# EAGLE design power (EAGLE 6.4)
PyRadio
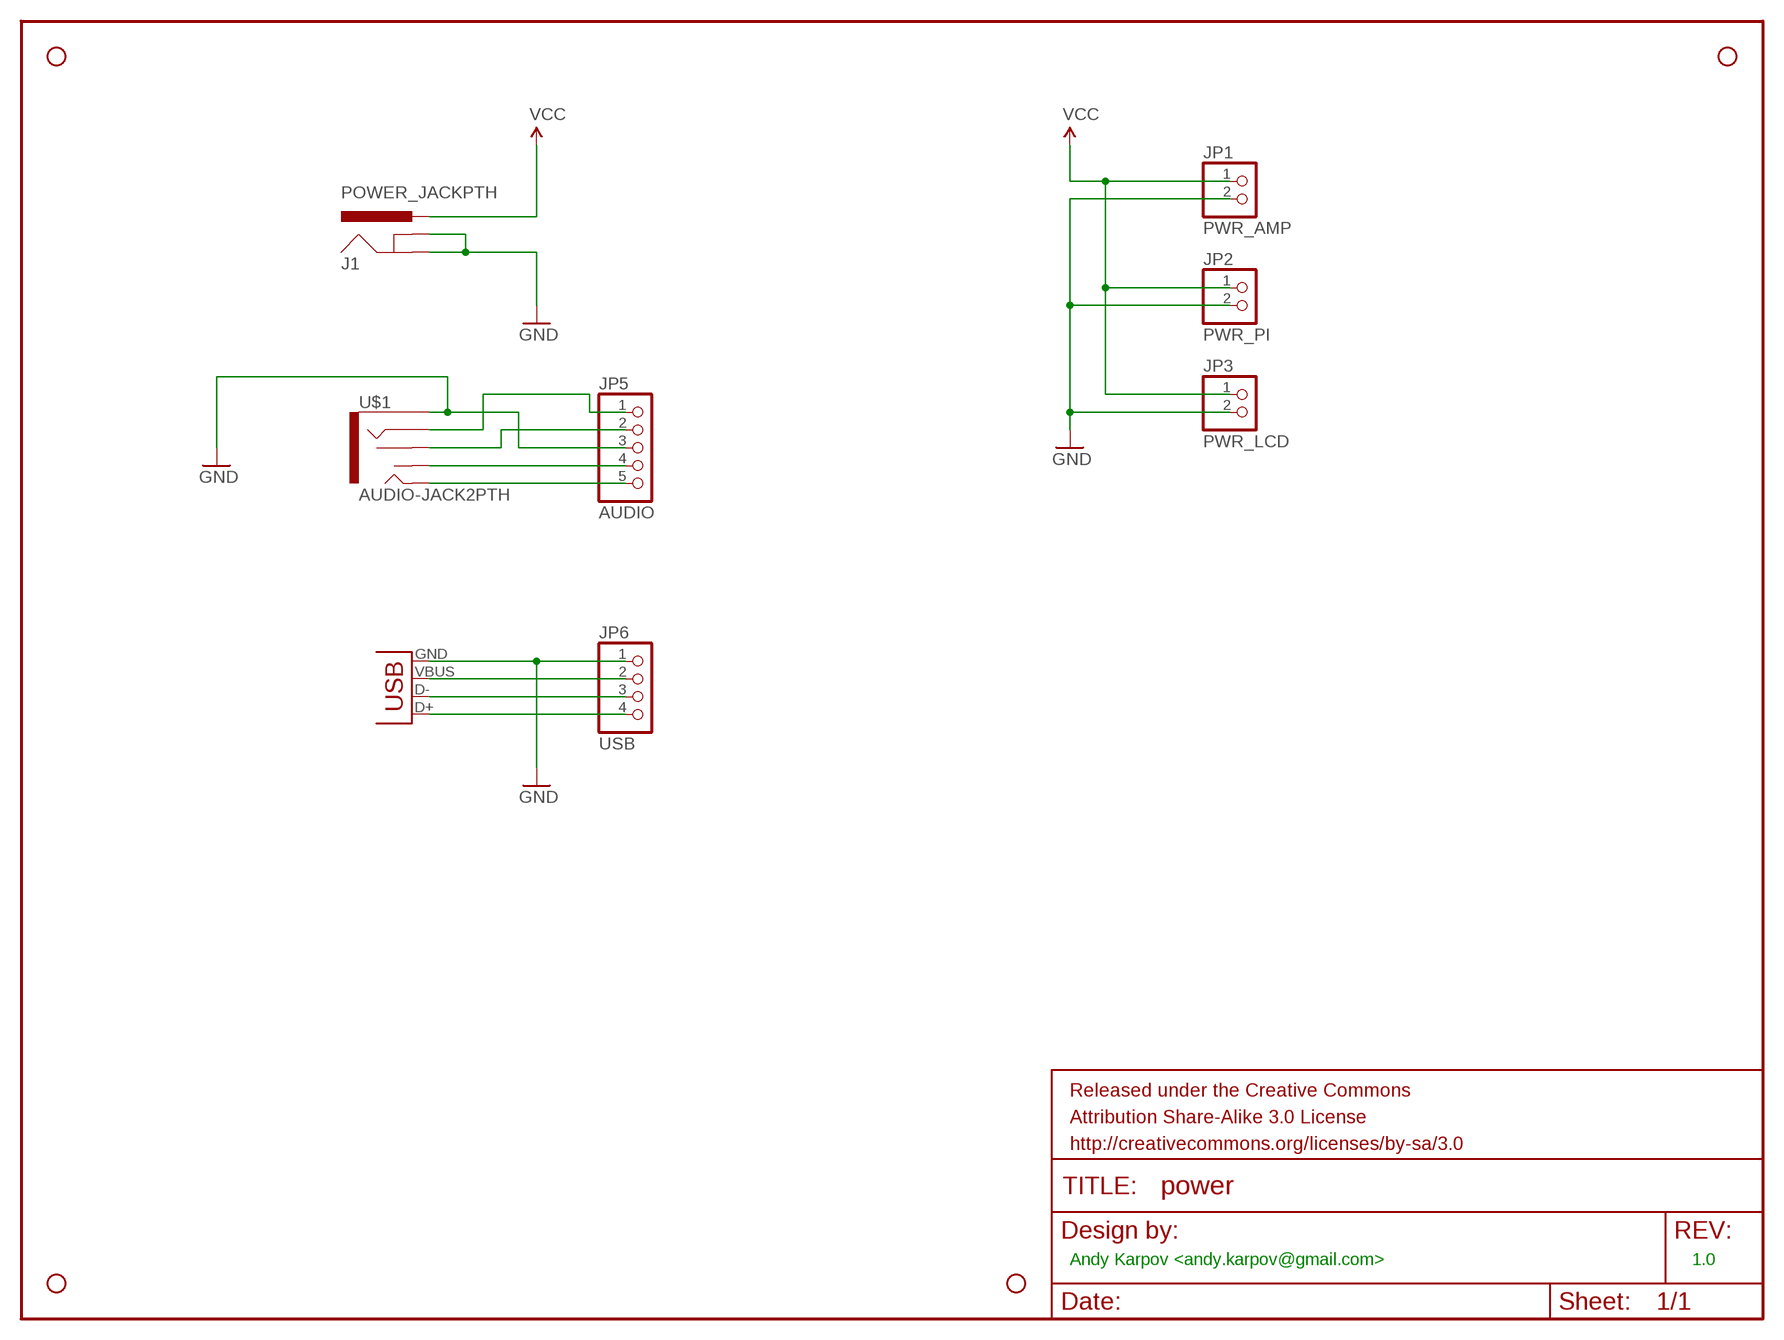
[diagram p0: schematic, sheet 1]

## Parts
FRAME1  FRAME-LETTER  [CREATIVE_COMMONS]
J1  POWER_JACKPTH  [POWER_JACK_PTH]
JP1  PWR_AMP  PINHD-1X2  [1X02]
JP2  PWR_PI  PINHD-1X2  [1X02]
JP3  PWR_LCD  PINHD-1X2  [1X02]
JP4  USB-B  USBPTH  [USB-B-PTH]
JP5  AUDIO  PINHD-1X5  [1X05]
JP6  USB  PINHD-1X4  [1X04]
STANDOFF1  STAND-OFF  [STAND-OFF]
STANDOFF2  STAND-OFF  [STAND-OFF]
STANDOFF3  STAND-OFF  [STAND-OFF]
STANDOFF4  STAND-OFF  [STAND-OFF]
U$1  AUDIO-JACK2PTH  [AUDIO-JACK]

## Nets
GND: J1.GND J1.GNDBREAK JP1.2 JP2.2 JP3.2 JP4.GND JP5.3 JP6.1 U$1.SLEEVE
N$2: JP4.D+ JP6.4
N$4: JP5.2 U$1.RSH
N$5: JP5.1 U$1.RING
N$10: JP4.VBUS JP6.2
N$11: JP4.D- JP6.3
N$26: JP5.5 U$1.TIP
N$27: JP5.4 U$1.TSH
VCC: J1.PWR JP1.1 JP2.1 JP3.1

## Notes on the sheet
- Andy Karpov <andy.karpov@gmail.com> | 1.0

## Library data of the parts
FRAME1 = SparkFun-Aesthetics:FRAME-LETTER: Schematic Frame Standard 8.5x11 US Letter frame
J1 = SparkFun-Connectors:POWER_JACK: Power Jack This is the standard 5.5mm barrel jack for power. The PTH is the most common, proven, reliable, footprint. The Slot footprint only works if the mill layer is transmitted to the PCB fab house so be warned. Spark Fun Electronics SKU : PRT-00119 SMT: CONN-08106 Mating wall wart : TOL-00298 (and others)
JP1-JP3 = pinhead:PINHD-1X2: PIN HEADER
JP4 = SparkFun-Connectors:USB: USB Connectors USB-B-PTH is fully proven SKU : PRT-00139/CONN-08278 USB-miniB is fully proven SKU : PRT-00587 USB-A-PCB is untested. USB-A-H is throughly reviewed, but untested. Spark Fun Electronics SKU : PRT-00437 USB-B-SMT is throughly reviewed, but untested. Needs silkscreen touching up. USB-A-S has not been used/tested USB-MB-H has not been used/tested USB-MICROB has been used. CONN-09505; PROD_ID: CONN-08278
JP5 = pinhead:PINHD-1X5: PIN HEADER
JP6 = pinhead:PINHD-1X4: PIN HEADER
STANDOFF1-STANDOFF4 = SparkFun-Electromechanical:STAND-OFF: #4 Stand Off This is the mechanical footprint for a #4 phillips button head screw. Use the keepout ring to avoid running the screw head into surrounding components. SKU : PRT-00447
U$1 = SparkFun-Connectors:AUDIO-JACK2: Stereo audio jack with bypass switches.

## Board
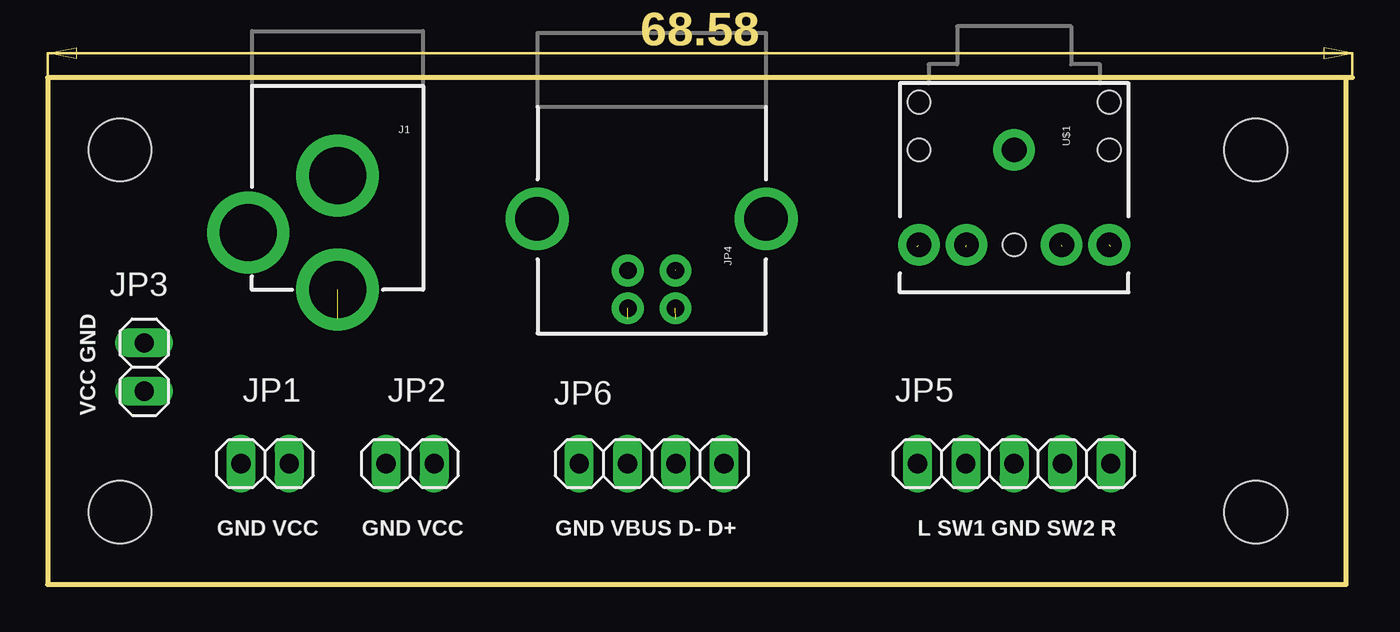
[diagram p1: board, top side]
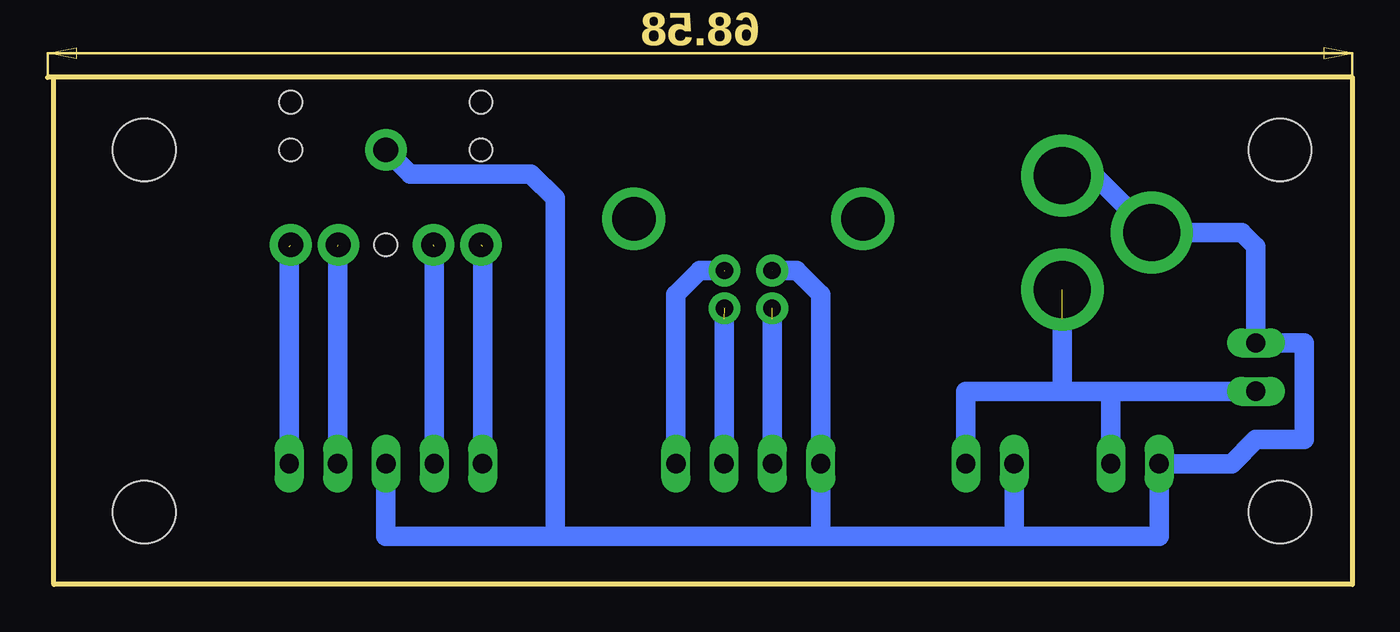
[diagram p2: board, bottom side, seen from below]

Size 68.58 x 26.67 mm. Coordinates in mm from the lower left corner, seen from the top.
Outline: 68.25,26.66 68.25,0 0,0 0,26.67 68.58,26.67
Copper layers (1*16): Top 0.035mm / dielectric 1.5mm / Bottom 0.035mm
Design rules "default": minimum track width 10mil, minimum drill 24mil, track to track 8mil, track to pad 8mil, pad to pad 8mil, via to via 8mil, smd to smd 8mil, copper to edge 40mil, drill to drill 8mil, minimum pad ring 10mil, minimum via ring 8mil, stop-mask expansion 4mil, vias tented up to drill 0mil, thermal gap 10mil

### Footprints (pad centres in the part's own frame; a part is rotated, then mirrored left to right if it is on the bottom)
POWER_JACK_PTH = drill 2.997 pad 4.318: GND 0,7.7; GNDBREAK 4.7,10.7; PWR 0,13.7
1X02 = drill 1.016 long: 1 -1.27,0; 2 1.27,0
USB-B-PTH = drill 0.914 pad 1.676: D+ 0,1.25; D- 1.981,1.25; GND 0,-1.25; VBUS 1.981,-1.25 | drill 2.286: S1 -2.718,-6.02; S2 -2.718,6.02
1X05 = drill 1.016 long: 1 -5.08,0; 2 -2.54,0; 3 0,0; 4 2.54,0; 5 5.08,0
1X04 = drill 1.016 long: 1 -3.81,0; 2 -1.27,0; 3 1.27,0; 4 3.81,0
STAND-OFF = hole 3.302: 0,0
AUDIO-JACK = drill 1.3 pad 2.184: RING 5,5; RSH 5,2.5; SLEEVE 0,0; TIP 5,-5; TSH 5,-2.5 | hole 1.2: 0,5; -2.5,5; -2.5,-5; 0,-5; 5,0

### Placement (x,y rotation side)
FRAME1  1.27,33.02 0 top  (outside the outline)
J1  15.24,29.21 180 top
JP1  11.43,6.35 180 top
JP2  19.05,6.35 180 top
JP3  5.08,11.43 90 top
JP4  31.75,16.51 270 top
JP5  50.8,6.35 180 top
JP6  31.75,6.35 0 top
STANDOFF1  63.5,3.81 0 top
STANDOFF2  3.81,3.81 0 top
STANDOFF3  3.81,22.86 0 top
STANDOFF4  63.5,22.86 0 top
U$1  50.8,22.86 270 top

### Tracks (layer width: path | path; a pad name or v marks a point on that pad's centre or on a via)
GND  (1 unrouted)
  Bottom 1.016: 30.48,16.51 29.21,16.51 27.94,15.24 JP6.1 27.94,2.54 | J1.GND 13.54,21.51 J1.GNDBREAK 5.81,18.51 5.08,17.78 JP3.2 2.54,12.7 2.54,7.62 5.08,7.62 6.35,6.35 JP1.2 10.16,2.54 17.78,2.54 | JP2.2 17.78,2.54 | 17.78,2.54 27.94,2.54 | JP5.3 50.8,2.54 41.91,2.54 | 41.91,2.54 27.94,2.54 | U$1.SLEEVE 49.53,21.59 43.18,21.59 41.91,20.32 41.91,2.54
N$2  (1 unrouted)
  Bottom 1.016: 33.02,16.51 34.29,16.51 35.56,15.24 JP6.4
N$4  (1 unrouted)
  Bottom 1.016: 53.34,17.78 JP5.2
N$5  (1 unrouted)
  Bottom 1.016: 55.88,17.78 JP5.1
N$10  (1 unrouted)
  Bottom 1.016: 30.48,13.97 JP6.2
N$11  (1 unrouted)
  Bottom 1.016: 33.02,13.97 JP6.3
N$26  (1 unrouted)
  Bottom 1.016: 45.72,17.78 JP5.5
N$27  (1 unrouted)
  Bottom 1.016: 48.26,17.78 JP5.4
VCC  (1 unrouted)
  Bottom 1.016: 15.24,13.97 15.24,10.16 | 12.7,10.16 JP1.1 | JP2.1 20.32,10.16 15.24,10.16 | 12.7,10.16 15.24,10.16 | JP3.1 12.7,10.16

### Text on the board
tPlace: VCC GND | GND VCC | GND VCC | GND VBUS D- D+ | L SW1 GND SW2 R